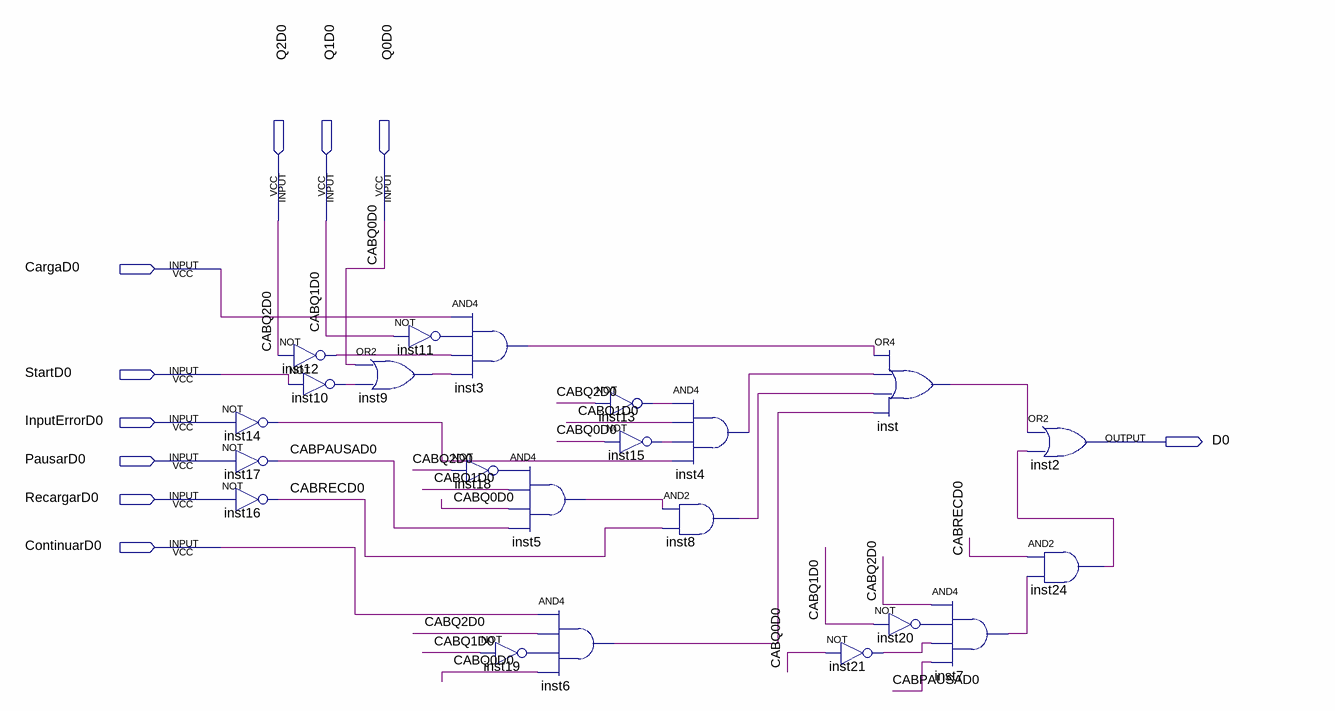
[diagram p0: schematic sheet]
// Quartus schematic ControllerD0.bdf as structural Verilog: 22 symbols, 10 pins
module ControllerD0 (
  input  Q2D0,
  input  Q1D0,
  input  Q0D0,
  input  CargaD0,
  input  StartD0,
  input  InputErrorD0,
  input  PausarD0,
  input  RecargarD0,
  input  ContinuarD0,
  output D0
);

  wire CABPAUSAD0, CABRECD0, inst3_out, inst4_out, inst5_out, inst6_out, inst7_out, inst8_out, inst9_out,
       inst10_out, inst11_out, inst12_out, inst13_out, inst14_out, inst15_out, inst18_out, inst19_out,
       inst20_out, inst21_out, inst24_out, inst_out;

  not inst14 (inst14_out, InputErrorD0);
  not inst17 (CABPAUSAD0, PausarD0);
  not inst16 (CABRECD0, RecargarD0);
  not inst12 (inst12_out, Q2D0);
  not inst10 (inst10_out, StartD0);
  not inst11 (inst11_out, Q1D0);
  or inst9 (inst9_out, Q0D0, inst10_out);
  and inst3 (inst3_out, CargaD0, inst11_out, inst12_out, inst9_out);
  not inst18 (inst18_out, Q2D0);
  and inst5 (inst5_out, inst18_out, Q1D0, Q0D0, CABPAUSAD0);
  and inst6 (inst6_out, ContinuarD0, Q2D0, inst19_out, Q0D0);
  not inst19 (inst19_out, Q1D0);
  not inst13 (inst13_out, Q2D0);
  not inst15 (inst15_out, Q0D0);
  and inst4 (inst4_out, inst13_out, Q1D0, inst15_out, inst14_out);
  and inst8 (inst8_out, inst5_out, CABRECD0);
  not inst21 (inst21_out, Q0D0);
  or inst (inst_out, inst3_out, inst4_out, inst8_out, inst6_out);
  and inst7 (inst7_out, Q2D0, inst20_out, inst21_out, CABPAUSAD0);
  not inst20 (inst20_out, Q1D0);
  or inst2 (D0, inst_out, inst24_out);
  and inst24 (inst24_out, CABRECD0, inst7_out);

  // Other names for the same wires on the sheet: CABQ0D0 = Q0D0; CABQ1D0 = Q1D0; CABQ2D0 = Q2D0
endmodule
